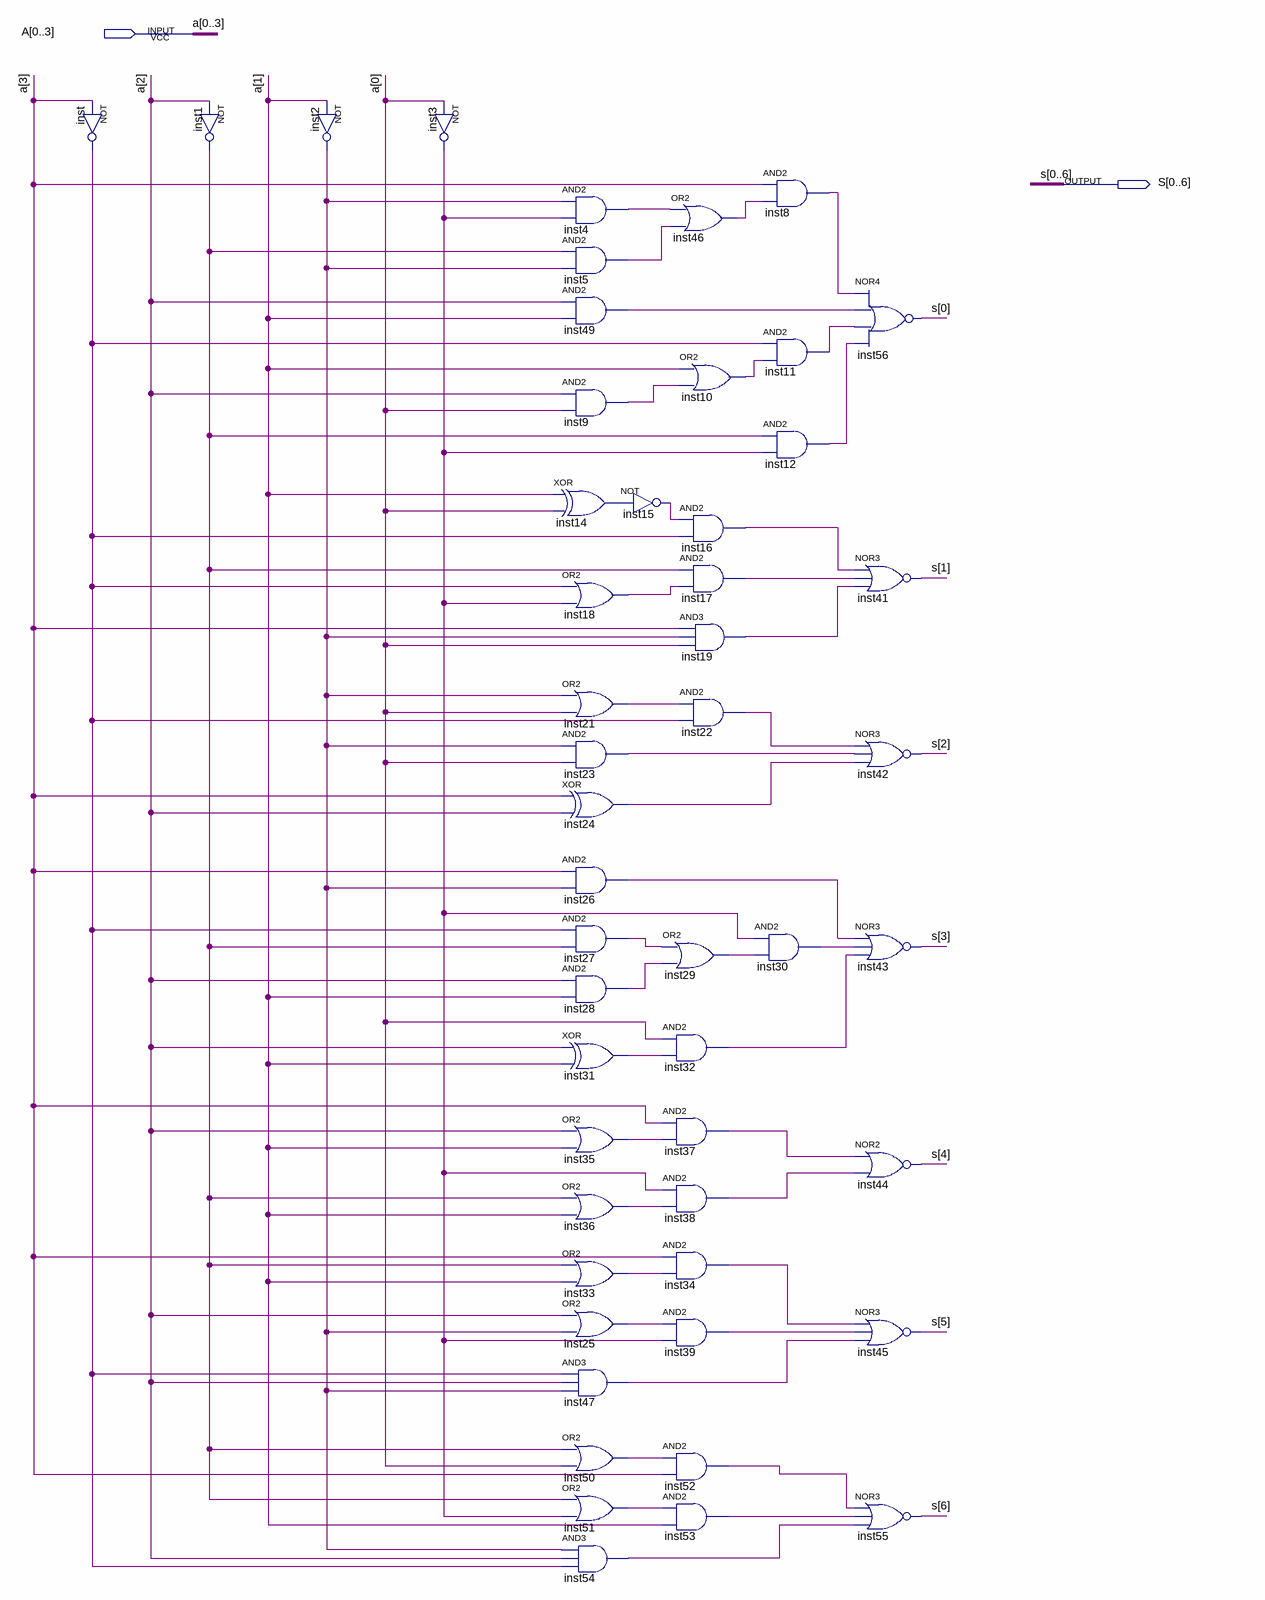
[diagram p0: schematic sheet]
// Quartus schematic 7seg.bdf as structural Verilog: 51 symbols, 2 pins
module \7seg  (
  input  [0:3] A,
  output [0:6] S
);

  wire inst1_out, inst2_out, inst3_out, inst4_out, inst5_out, inst8_out, inst9_out, inst10_out, inst11_out,
       inst12_out, inst14_out, inst15_out, inst16_out, inst17_out, inst18_out, inst19_out, inst21_out,
       inst22_out, inst23_out, inst24_out, inst25_out, inst26_out, inst27_out, inst28_out, inst29_out,
       inst30_out, inst31_out, inst32_out, inst33_out, inst34_out, inst35_out, inst36_out, inst37_out,
       inst38_out, inst39_out, inst46_out, inst47_out, inst49_out, inst50_out, inst51_out, inst52_out,
       inst53_out, inst54_out, inst_out;

  not inst (inst_out, A[3]);
  not inst1 (inst1_out, A[2]);
  not inst2 (inst2_out, A[1]);
  not inst3 (inst3_out, A[0]);
  and inst4 (inst4_out, inst2_out, inst3_out);
  and inst5 (inst5_out, inst1_out, inst2_out);
  and inst49 (inst49_out, A[2], A[1]);
  and inst9 (inst9_out, A[2], A[0]);
  xor inst14 (inst14_out, A[1], A[0]);
  or inst18 (inst18_out, inst_out, inst3_out);
  or inst21 (inst21_out, inst2_out, A[0]);
  and inst23 (inst23_out, inst2_out, A[0]);
  xor inst24 (inst24_out, A[3], A[2]);
  and inst26 (inst26_out, A[3], inst2_out);
  and inst27 (inst27_out, inst_out, inst1_out);
  and inst28 (inst28_out, A[2], A[1]);
  xor inst31 (inst31_out, A[2], A[1]);
  or inst35 (inst35_out, A[2], A[1]);
  or inst36 (inst36_out, inst1_out, A[1]);
  or inst33 (inst33_out, inst1_out, A[1]);
  or inst25 (inst25_out, A[2], inst2_out);
  and inst47 (inst47_out, inst_out, A[2], inst2_out);
  or inst50 (inst50_out, inst1_out, A[0]);
  or inst51 (inst51_out, inst1_out, inst3_out);
  and inst54 (inst54_out, inst2_out, A[2], inst_out);
  or inst46 (inst46_out, inst4_out, inst5_out);
  not inst15 (inst15_out, inst14_out);
  or inst29 (inst29_out, inst27_out, inst28_out);
  and inst32 (inst32_out, A[0], inst31_out);
  and inst37 (inst37_out, A[3], inst35_out);
  and inst38 (inst38_out, inst3_out, inst36_out);
  and inst34 (inst34_out, A[3], inst33_out);
  and inst39 (inst39_out, inst25_out, inst3_out);
  and inst52 (inst52_out, inst50_out, A[3]);
  and inst53 (inst53_out, inst51_out, A[1]);
  or inst10 (inst10_out, A[1], inst9_out);
  and inst16 (inst16_out, inst15_out, inst_out);
  and inst17 (inst17_out, inst1_out, inst18_out);
  and inst19 (inst19_out, A[3], inst2_out, A[0]);
  and inst22 (inst22_out, inst21_out, inst_out);
  and inst8 (inst8_out, A[3], inst46_out);
  and inst11 (inst11_out, inst_out, inst10_out);
  and inst12 (inst12_out, inst1_out, inst3_out);
  and inst30 (inst30_out, inst3_out, inst29_out);
  nor inst56 (S[0], inst8_out, inst49_out, inst11_out, inst12_out);
  nor inst41 (S[1], inst16_out, inst17_out, inst19_out);
  nor inst42 (S[2], inst22_out, inst23_out, inst24_out);
  nor inst43 (S[3], inst26_out, inst30_out, inst32_out);
  nor inst44 (S[4], inst37_out, inst38_out);
  nor inst45 (S[5], inst34_out, inst39_out, inst47_out);
  nor inst55 (S[6], inst52_out, inst53_out, inst54_out);
endmodule
